# EAGLE design Rain Sensor (EAGLE 9.6.2)
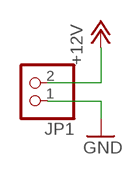
[diagram p0: schematic, sheet 1]

## Parts
JP1  PINHD-1X2/90  [1X02/90]

## Nets
+12V: JP1.2
GND: JP1.1

## Library data of the parts
JP1 = pinhead:PINHD-1X2: PIN HEADER

## Board
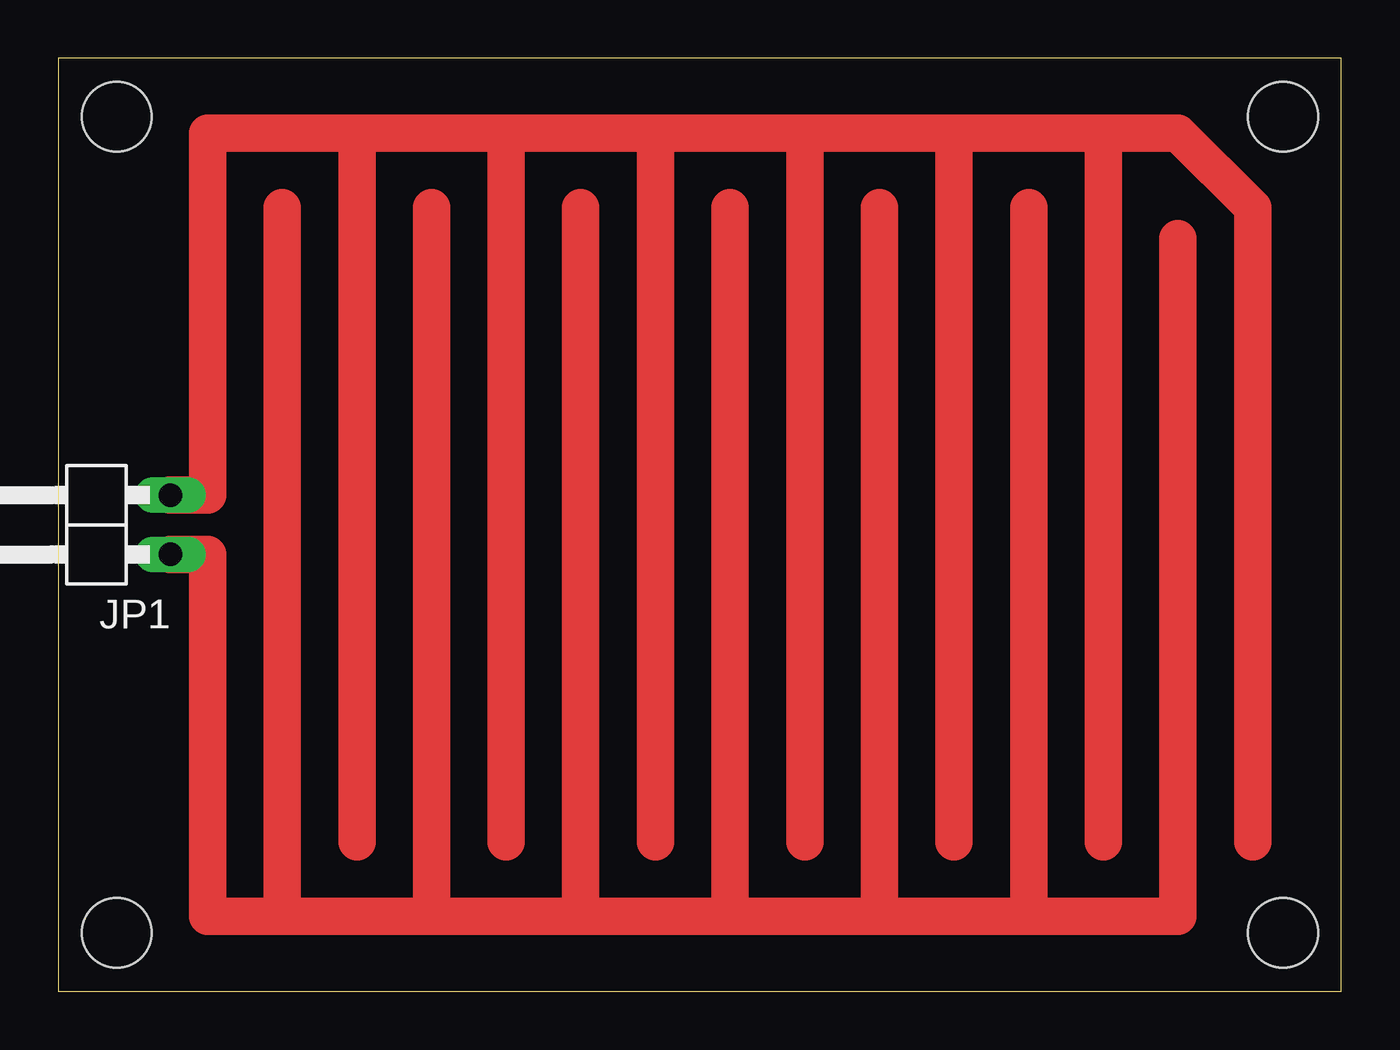
[diagram p1: board, top side]

Size 55 x 40 mm. Coordinates in mm from the lower left corner, seen from the top.
Outline: 0,0 55,0 55,40 0,40 0,0
Copper layers (1*16): Top 0.035mm / dielectric 1.5mm / Bottom 0.035mm
Design rules "default *": minimum track width 0.8mm, minimum drill 0.7mm, track to track 1.6mm, track to pad 1.6mm, pad to pad 1.6mm, via to via 1.6mm, smd to smd 1.6mm, copper to edge 40mil, drill to drill 6mil, minimum pad ring 10mil, minimum via ring 8mil, stop-mask expansion 4mil, vias tented up to drill 0mil, thermal gap 10mil
Holes 3 mm at 2.5,2.5 2.5,37.5 52.5,37.5 52.5,2.5

### Footprints (pad centres in the part's own frame; a part is rotated, then mirrored left to right if it is on the bottom)
1X02/90 = drill 1.016 long: 1 -1.27,-3.81; 2 1.27,-3.81

### Placement (x,y rotation side)
JP1  1,20 90 top

### Tracks (layer width: path | path; a pad name or v marks a point on that pad's centre or on a via)
+12V
  Top 1.6: JP1.2 6.4,21.27 6.4,36.8 11.2,36.8 12.8,36.8 | 51.2,6.4 51.2,33.6 48,36.8 44.8,36.8 | 12.8,36.8 19.2,36.8 | 19.2,36.8 25.6,36.8 | 25.6,36.8 32,36.8 | 32,36.8 38.4,36.8 | 38.4,36.8 44.8,36.8 | 44.8,36.8 44.8,6.4 | 38.4,6.4 38.4,36.8 | 32,6.4 32,36.8 | 25.6,6.4 25.6,36.8 | 19.2,6.4 19.2,36.8 | 12.8,36.8 12.8,6.4
GND
  Top 1.6: JP1.1 6.4,18.73 6.4,3.2 9.6,3.2 | 9.6,3.2 16,3.2 | 16,3.2 22.4,3.2 | 22.4,3.2 28.8,3.2 | 28.8,3.2 35.2,3.2 | 41.6,3.2 48,3.2 48,32.27 | 41.6,33.6 41.6,3.2 | 41.6,3.2 35.2,3.2 | 35.2,3.2 35.2,33.6 | 28.8,3.2 28.8,33.6 | 22.4,3.2 22.4,33.6 | 16,33.6 16,3.2 | 9.6,3.2 9.6,33.6